# Altium schematic sheet In_Prev_Channel.SchDoc
size A4
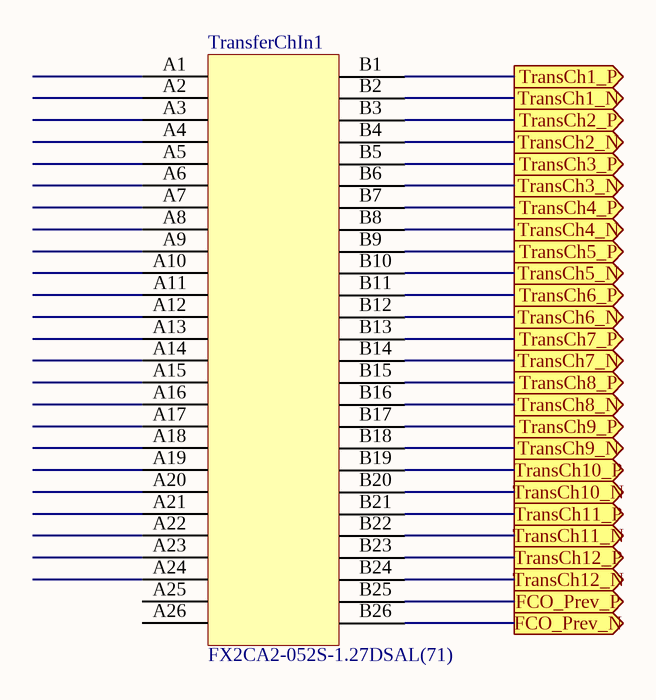
[diagram p0: In_Prev_Channel.SchDoc]

## Parts
TransferChIn1  FX2CA2-052S-1.27DSAL(71)  [FX2CA2-052S-1.27DSAL(71)]

## Ports
FCO_Prev_N (out), FCO_Prev_P (out), TransCh1_N (out), TransCh1_P (out), TransCh2_N (out), TransCh2_P (out), TransCh3_N (out), TransCh3_P (out), TransCh4_N (out), TransCh4_P (out), TransCh5_N (out), TransCh5_P (out), TransCh6_N (out), TransCh6_P (out), TransCh7_N (out), TransCh7_P (out), TransCh8_N (out), TransCh8_P (out), TransCh9_N (out), TransCh9_P (out), TransCh10_N (out), TransCh10_P (out), TransCh11_N (out), TransCh11_P (out), TransCh12_N (out), TransCh12_P (out)

## Nets
FCO_Prev_N: TransferChIn1.B26 ; port FCO_Prev_N
FCO_Prev_P: TransferChIn1.B25 ; port FCO_Prev_P
TransCh1_N: TransferChIn1.B2 ; port TransCh1_N
TransCh1_P: TransferChIn1.B1 ; port TransCh1_P
TransCh2_N: TransferChIn1.B4 ; port TransCh2_N
TransCh2_P: TransferChIn1.B3 ; port TransCh2_P
TransCh3_N: TransferChIn1.B6 ; port TransCh3_N
TransCh3_P: TransferChIn1.B5 ; port TransCh3_P
TransCh4_N: TransferChIn1.B8 ; port TransCh4_N
TransCh4_P: TransferChIn1.B7 ; port TransCh4_P
TransCh5_N: TransferChIn1.B10 ; port TransCh5_N
TransCh5_P: TransferChIn1.B9 ; port TransCh5_P
TransCh6_N: TransferChIn1.B12 ; port TransCh6_N
TransCh6_P: TransferChIn1.B11 ; port TransCh6_P
TransCh7_N: TransferChIn1.B14 ; port TransCh7_N
TransCh7_P: TransferChIn1.B13 ; port TransCh7_P
TransCh8_N: TransferChIn1.B16 ; port TransCh8_N
TransCh8_P: TransferChIn1.B15 ; port TransCh8_P
TransCh9_N: TransferChIn1.B18 ; port TransCh9_N
TransCh9_P: TransferChIn1.B17 ; port TransCh9_P
TransCh10_N: TransferChIn1.B20 ; port TransCh10_N
TransCh10_P: TransferChIn1.B19 ; port TransCh10_P
TransCh11_N: TransferChIn1.B22 ; port TransCh11_N
TransCh11_P: TransferChIn1.B21 ; port TransCh11_P
TransCh12_N: TransferChIn1.B24 ; port TransCh12_N
TransCh12_P: TransferChIn1.B23 ; port TransCh12_P

Not connected (* = marked no-connect by the designer): TransferChIn1 A1(1) A2(2) A3(3) A4(4) A5(5) A6(6) A7(7) A8(8) A9(9) A10(10) A11(11) A12(12) A13(13) A14(14) A15(15) A16(16) A17(17) A18(18) A19(19) A20(20) A21 A22 A23 A24 A25 A26